# Altium project 4S SMART BMS.PrjPcb (part 3 of 6)

## Sheet MCU.SchDoc
size A4; SheetNumber: 4; SheetTotal: 7
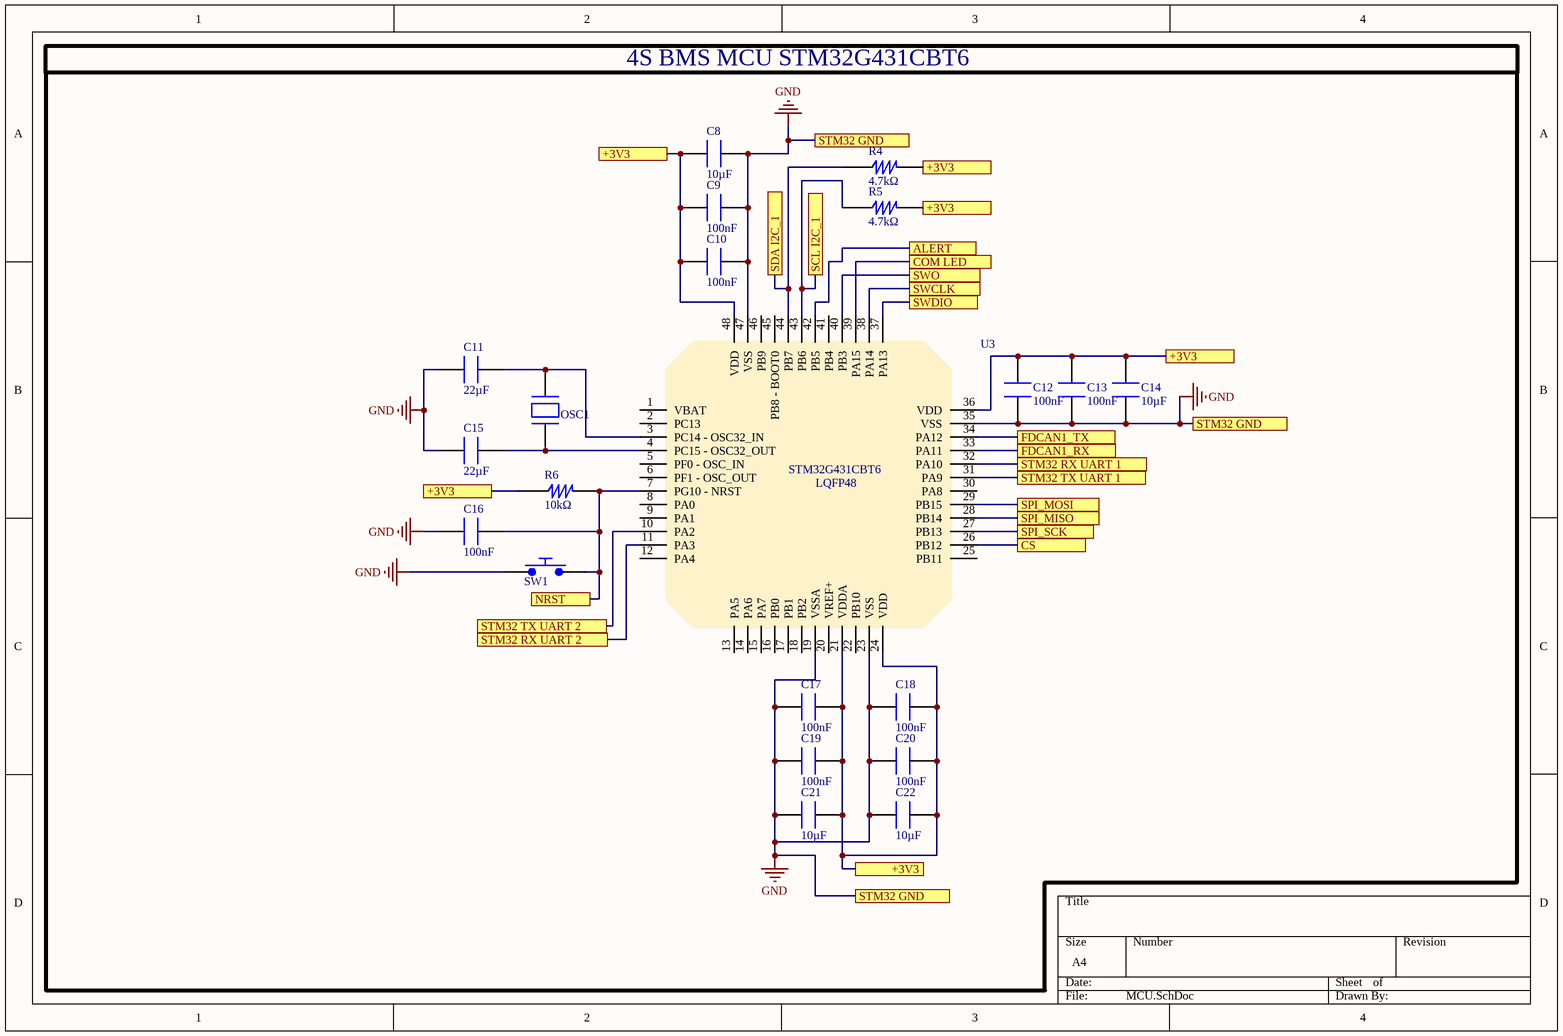
[diagram p3: MCU.SchDoc]

### Parts
C8  value 10µF  [CAP CER 0805]  (hidden comment: CL21B106KQQNNNG)
C9  value 100nF  [CAP CER 0603]  (hidden comment: KGM15AR70J104JT)
C10  value 100nF  [CAP CER 0603]  (hidden comment: KGM15AR70J104JT)
C11  value 22µF  [CAP CER 1210]  (hidden comment: C1210C226J8RACTU)
C12  value 100nF  [CAP CER 0603]  (hidden comment: KGM15AR70J104JT)
C13  value 100nF  [CAP CER 0603]  (hidden comment: KGM15AR70J104JT)
C14  value 10µF  [CAP CER 0805]  (hidden comment: CL21B106KQQNNNG)
C15  value 22µF  [CAP CER 1210]  (hidden comment: C1210C226J8RACTU)
C16  value 100nF  [CAP CER 0603]  (hidden comment: KGM15AR70J104JT)
C17  value 100nF  [CAP CER 0603]  (hidden comment: KGM15AR70J104JT)
C18  value 100nF  [CAP CER 0603]  (hidden comment: KGM15AR70J104JT)
C19  value 100nF  [CAP CER 0603]  (hidden comment: KGM15AR70J104JT)
C20  value 100nF  [CAP CER 0603]  (hidden comment: KGM15AR70J104JT)
C21  value 10µF  [CAP CER 0805]  (hidden comment: CL21B106KQQNNNG)
C22  value 10µF  [CAP CER 0805]  (hidden comment: CL21B106KQQNNNG)
OSC1  END4263D-32M  [OSC_4-SMD, No Lead]  (value not drawn)
R4  value 4.7kΩ  [RES 0603]  (hidden comment: ERA-3AEB472V)
R5  value 4.7kΩ  [RES 0603]  (hidden comment: ERA-3AEB472V)
R6  value 10kΩ  [RES 0603]  (hidden comment: RMCF0603FT10K0)
SW1  PTS636SM50JSMTR LFS  [SWITCH TACTILE]  (value not drawn)
U3  STM32G431CBT6  [LQFP48]  (value not drawn)

### Ports
+3V3 (see COM[1C], COM[3C], COM[3D], COM[4B], ESP32 and Flash[2A], ESP32 and Flash[3A], MCU[2A], MCU[2B], MCU[3A], MCU[3B], MCU[3D], Power[3B], Power[4A]), +3V3 (see COM[1C], COM[3C], COM[3D], COM[4B], ESP32 and Flash[2A], ESP32 and Flash[3A], MCU[2A], MCU[2B], MCU[3A], MCU[3B], Power[3B], Power[4A]), +3V3 (see COM[1C], COM[3C], COM[3D], COM[4B], ESP32 and Flash[2A], ESP32 and Flash[3A], MCU[2A], MCU[2B], MCU[3A], MCU[3D], Power[3B], Power[4A]), +3V3 (see COM[1C], COM[3C], COM[3D], COM[4B], ESP32 and Flash[2A], ESP32 and Flash[3A], MCU[2A], MCU[3A], MCU[3B], MCU[3D], Power[3B], Power[4A]), +3V3 (see COM[1C], COM[3C], COM[3D], COM[4B], ESP32 and Flash[2A], ESP32 and Flash[3A], MCU[2B], MCU[3A], MCU[3B], MCU[3D], Power[3B], Power[4A]), ALERT (see AFE and MOSFETs[2A]), COM LED (see COM[3D]), CS (see ESP32 and Flash[3A]), FDCAN1_RX (see COM[2D]), FDCAN1_TX (see COM[2D]), NRST (see COM[1C], COM[3B]), SCL I2C_1 (see AFE and MOSFETs[1A]), SDA I2C_1 (see AFE and MOSFETs[1A]), SPI_MISO (see ESP32 and Flash[3B]), SPI_MOSI (see ESP32 and Flash[3B]), SPI_SCK (see ESP32 and Flash[3A]), STM32 GND (see COM[1B], COM[1D], COM[2C], COM[2D], COM[3B], COM[4D], ESP32 and Flash[2C], MCU[3A], MCU[3D], Power[1C], Power[2B]), STM32 GND (see COM[1B], COM[1D], COM[2C], COM[2D], COM[3B], COM[4D], ESP32 and Flash[2C], MCU[3A], MCU[4B], Power[1C], Power[2B]), STM32 GND (see COM[1B], COM[1D], COM[2C], COM[2D], COM[3B], COM[4D], ESP32 and Flash[2C], MCU[3D], MCU[4B], Power[1C], Power[2B]), STM32 RX UART 1 (see COM[3B]), STM32 RX UART 2 (see ESP32 and Flash[1B]), STM32 TX UART 1 (see COM[3B]), STM32 TX UART 2 (see ESP32 and Flash[1B]), SWCLK (see COM[1D]), SWDIO (see COM[1D]), SWO (see COM[1D])

### Nets
GND: C8.1 C9.1 C10.1 C11.2 C12.1 C13.1 C14.1 C15.2 C16.2 C17.1 C18.1 C19.1 C20.1 C21.1 C22.1 SW1.1 U3.19(VSSA) U3.23(VSS) U3.35(VSS) U3.47(VSS) ; port STM32 GND
NetC4_1: C8.2 C9.2 C10.2 C12.2 C13.2 C14.2 C17.2 C18.2 C19.2 C20.2 C21.2 C22.2 R4.2 R5.2 R6.1 U3.21(VDDA) U3.24(VDD) U3.36(VDD) U3.48(VDD) ; port +3V3
NetC11_1: C11.1 OSC1.2 U3.3(PC14_-_OSC32_IN)
NetC15_1: C15.1 OSC1.1 U3.4(PC15_-_OSC32_OUT)
NetC16_1: C16.1 R6.2 SW1.2 U3.7(PG10_-_NRST) ; port NRST
NetJ3_2: U3.37(PA13) ; port SWDIO
NetJ3_4: U3.38(PA14) ; port SWCLK
NetJ3_6: U3.40(PB3) ; port SWO
NetR4_1: R4.1 U3.44(PB7) ; port SDA I2C_1
NetR5_1: R5.1 U3.43(PB6) ; port SCL I2C_1
NetR16_1: U3.39(PA15) ; port COM LED
NetU3_10: U3.10(PA2) ; port STM32 TX UART 2
NetU3_11: U3.11(PA3) ; port STM32 RX UART 2
NetU3_26: U3.26(PB12) ; port CS
NetU3_27: U3.27(PB13) ; port SPI_SCK
NetU3_28: U3.28(PB14) ; port SPI_MISO
NetU3_29: U3.29(PB15) ; port SPI_MOSI
NetU3_31: U3.31(PA9) ; port STM32 TX UART 1
NetU3_32: U3.32(PA10) ; port STM32 RX UART 1
NetU3_33: U3.33(PA11) ; port FDCAN1_RX
NetU3_34: U3.34(PA12) ; port FDCAN1_TX
NetU3_42: U3.42(PB5) ; port ALERT

Not connected (* = marked no-connect by the designer): U3 1(VBAT) 2(PC13) 5(PF0_-_OSC_IN) 6(PF1_-_OSC_OUT) 8(PA0) 9(PA1) 12(PA4) 13(PA5) 14(PA6) 15(PA7) 16(PB0) 17(PB1) 18(PB2) 20(VREF+) 22(PB10) 25(PB11) 30(PA8) 41(PB4) 45(PB8_-_BOOT0) 46(PB9)

### Notes on the sheet
- 4S BMS MCU STM32G431CBT6
- (in symbol STM32G431CBT6) LQFP48

### Library data of the parts
C8 C14 C21 C22 = CAP CER 10UF 6.3V 0805: 10 µF ±10% 6.3V Ceramic Capacitor X7R 0805 (2012 Metric); Manufacturer: Samsung Electro-Mechanics; Supplier: Arrow Electronics; Supplier Part Number: CL21B106KQQNNNG; Manufacturer Part Number: CL21B106KQQNNNG; RoHS: Compliant; Category: Ceramic Capacitors; Stock: 330626; Pricing: 1=0,0256, 10=0,011, 25=0,011, 100=0,008, 250=0,008, 500=0,007, 1000=0,006, 3000=0,006, 6000=0,005, 15000=0,005, 30000=0,005, 75000=0,004, 150000=0,004 (USD); Case/Package: 0805; Case Code (Imperial): 0805; Case Code (Metric): 2012; China RoHS: Compliant; Depth: 1.25mm; Dielectric: X7R; Dielectric Material: Ceramic; Height: 1.4mm; Lead Free: Lead Free; Length: 2mm; Lifecycle Status: Production; Material: Ceramic; Max Operating Temperature: 125°C; Min Operating Temperature: -55°C; Mounting Technology: Surface Mount; Number of Terminals: 2; REACH SVHC: Yes; Schedule B: 8532240020, 8532240020|8532240020, 8532240020|8532240020|8532240020, 8532240020|8532240020|8532240020|8532240020; Thickness: 1.397mm; Tolerance: 10%; Voltage: 6.3V; Voltage Rating: 6.3V; Voltage Rating (DC): 6.3V; Width: 1.25mm; ComponentLink1URL: https://datasheet.octopart.com:443/CL21B106KQQNNNG-Samsung-Electro-Mechanics-datasheet-182023452.pdf?src-supplier=IHS; ComponentLink1Description: https://datasheet.octopart.com:443/CL21B106KQQNNNG-Samsung-Electro-Mechanics-datasheet-182023452.pdf?src-supplier=IHS; ComponentLink2URL: https://datasheet.octopart.com:443/CL21B106KQQNNNG-Samsung-Electro-Mechanics-datasheet-136482505.pdf?src-supplier=Samsung+SCT; ComponentLink2Description: https://datasheet.octopart.com:443/CL21B106KQQNNNG-Samsung-Electro-Mechanics-datasheet-136482505.pdf?src-supplier=Samsung+SCT; ComponentLink3URL: https://datasheet.octopart.com:443/CL21B106KQQNNNG-Samsung-Electro-Mechanics-datasheet-116891051.pdf?src-supplier=Future+Electronics; ComponentLink3Description: https://datasheet.octopart.com:443/CL21B106KQQNNNG-Samsung-Electro-Mechanics-datasheet-116891051.pdf?src-supplier=Future+Electronics; ComponentLink4URL: https://datasheet.octopart.com:443/CL21B106KQQNNNG-Samsung-Electro-Mechanics-datasheet-81462194.pdf?src-supplier=Future+Electronics; ComponentLink4Description: https://datasheet.octopart.com:443/CL21B106KQQNNNG-Samsung-Electro-Mechanics-datasheet-81462194.pdf?src-supplier=Future+Electronics; ComponentLink5URL: https://datasheet.octopart.com:443/CL21B106KQQNNNG-Samsung-datasheet-26669288.pdf?src-supplier=Future+Electronics; ComponentLink5Description: https://datasheet.octopart.com:443/CL21B106KQQNNNG-Samsung-datasheet-26669288.pdf?src-supplier=Future+Electronics; ComponentLink6URL: https://datasheet.octopart.com:443/CL21B106KQQNNNG-Samsung-datasheet-8324245.pdf?src-supplier=Future+Electronics; ComponentLink6Description: https://datasheet.octopart.com:443/CL21B106KQQNNNG-Samsung-datasheet-8324245.pdf?src-supplier=Future+Electronics; ComponentLink7URL: https://datasheet.octopart.com:443/CL21B106KQQNNNG-Samsung-Electro-Mechanics-datasheet-149045989.pdf?src-supplier=Future+Electronics; ComponentLink7Description: https://datasheet.octopart.com:443/CL21B106KQQNNNG-Samsung-Electro-Mechanics-datasheet-149045989.pdf?src-supplier=Future+Electronics; ComponentLink8URL: https://datasheet.octopart.com:443/CL21B106KQQNNNG-Samsung-datasheet-37081328.pdf?src-supplier=Future+Electronics; ComponentLink8Description: https://datasheet.octopart.com:443/CL21B106KQQNNNG-Samsung-datasheet-37081328.pdf?src-supplier=Future+Electronics; ComponentLink9URL: https://datasheet.octopart.com/CL21B106KQQNNNG-Samsung-Electro-Mechanics-datasheet-97040617.pdf; ComponentLink9Description: https://datasheet.octopart.com/CL21B106KQQNNNG-Samsung-Electro-Mechanics-datasheet-97040617.pdf; ComponentLink10URL: https://datasheet.octopart.com:443/CL21B106KQQNNNG-Samsung-datasheet-59220082.pdf?src-supplier=TME; ComponentLink10Description: https://datasheet.octopart.com:443/CL21B106KQQNNNG-Samsung-datasheet-59220082.pdf?src-supplier=TME
C9 C10 C12 C13 C16-C20 = CAP CER 0.1UF 6.3V 0603: 0.1 µF ±5% 6.3V Ceramic Capacitor X7R 0603 (1608 Metric); Manufacturer: KYOCERA AVX; Supplier: Arrow Electronics; Supplier Part Number: KGM15AR70J104JT; Manufacturer Part Number: KGM15AR70J104JT; RoHS: Compliant; Category: Ceramic Capacitors; Stock: 2087; Pricing: 1=0,019, 10=0,019, 25=0,019, 100=0,018, 250=0,018, 500=0,018, 1000=0,018 (USD); Dielectric Material: Ceramic; Height: 900µm; Length: 1.6mm; Lifecycle Status: Production; Max Operating Temperature: 125°C; Min Operating Temperature: -55°C; Mounting Technology: Surface Mount; Number of Terminals: 2; REACH SVHC: Yes; Voltage Rating (DC): 6.3V; Width: 810µm; ComponentLink1URL: https://datasheet.octopart.com:443/KGM15AR70J104JT-KYOCERA-AVX-datasheet-179280988.pdf?src-supplier=IHS; ComponentLink1Description: https://datasheet.octopart.com:443/KGM15AR70J104JT-KYOCERA-AVX-datasheet-179280988.pdf?src-supplier=IHS
C11 C15 = CAP CER 22UF 10V 1210: CAP CER 22UF 10V X7R 1210; Manufacturer: KEMET; Dielectric Material: Ceramic; Tolerance: 5%; Supplier: Arrow Electronics; Supplier Part Number: C1210C226J8RACTU; Manufacturer Part Number: C1210C226J8RACTU; RoHS: Compliant; Category: Ceramic Capacitors; Pricing: 1000=2,466, 2000=2,456, 3000=2,445, 4000=2,434, 5000=2,422, 6000=2,411, 10000=2,4, 20000=2,388, 50000=2,376 (USD); Case/Package: 1210; China RoHS: Compliant; Dielectric: X7R; Height: 2.5mm; Length: 3.2mm; Lifecycle Status: Production; Max Operating Temperature: 125°C; Min Operating Temperature: -55°C; Mounting Technology: Surface Mount; Number of Terminals: 2; REACH SVHC: Yes; Voltage Rating (DC): 10V; Width: 2.5mm; ComponentLink1URL: https://datasheet.octopart.com:443/C1210C226J8RACTU-KEMET-datasheet-178445679.pdf?src-supplier=IHS; ComponentLink1Description: https://datasheet.octopart.com:443/C1210C226J8RACTU-KEMET-datasheet-178445679.pdf?src-supplier=IHS; ComponentLink2URL: https://datasheet.octopart.com/C1210C226J8RACTU-KEMET-datasheet-84169754.pdf; ComponentLink2Description: https://datasheet.octopart.com/C1210C226J8RACTU-KEMET-datasheet-84169754.pdf
OSC1 = 32 MHz OSCİLLATOR: 32 MHz TCXO Clipped Sine Wave Oscillator 1.65V ~ 3.65V 4-SMD, No Lead; Base Resonator: Crystal; Frequency: 32 MHz; Frequency Stability: ±2.5ppm; Current - Supply (Max): 2mA; Type: TCXO; Output: Clipped Sine Wave; Voltage - Supply: 1.65V ~ 3.65V; Operating Temperature: -30°C ~ 85°C; Mounting Type: Surface Mount; Package / Case: 4-SMD, No Lead; Size / Dimension: 0.079" L x 0.063" W (2.00mm x 1.60mm)
R4 R5 = RES 4.7K OHM 1/10W 0603: Res Thin Film 0603 4.7K Ohm 0.1% 0.1W ±25ppm/°C Molded SMD Punched Carrier T/R; Manufacturer: Panasonic; Manufacturer Part Number: ERA-3AEB473V; Max Power Dissipation: 100mW; Voltage Rating: 75V; Supplier: Arrow Electronics; Supplier Part Number: ERA-3AEB473V; RoHS: Compliant; Category: Chip SMD Resistors; Stock: 25000; Pricing: 5000=0,0337, 10000=0,032, 15000=0,031, 20000=0,031, 25000=0,03 (USD); Case/Package: 0603; Case Code (Imperial): 0603; Composition: Thin Film; Contact Plating: Tin; Depth: 800µm; Features: Automotive AEC-Q200; Height: 450µm; Lead Free: Lead Free; Length: 1.6mm; Lifecycle Status: Production; Max Operating Temperature: 155°C; Military Standard: Not; Min Operating Temperature: -55°C; Mounting Technology: Surface Mount; Pins: 2; Number of Terminals: 2; Number of Terminations: 2; Packaging: Cut Tape; Power Dissipation: 100mW; Power Rating: 100mW; Radiation Hardening: No; REACH SVHC: Yes; Schedule B: 8533210045, 8533210045|8533210045|8533210045|8533210045|8533210045; Temperature Coefficient: 25ppm/°C; Termination: SMD/SMT; Tolerance: 0.1%; Voltage Rating (DC): 75V; Width: 800µm; Working Voltage: 75V; ComponentLink1URL: https://datasheet.octopart.com:443/ERA-3AEB473V-Panasonic-datasheet-62287448.pdf?src-supplier=Newark; ComponentLink1Description: https://datasheet.octopart.com:443/ERA-3AEB473V-Panasonic-datasheet-62287448.pdf?src-supplier=Newark; ComponentLink2URL: https://datasheet.octopart.com:443/ERA-3AEB473V-Panasonic-datasheet-136531316.pdf?src-supplier=Newark; ComponentLink2Description: https://datasheet.octopart.com:443/ERA-3AEB473V-Panasonic-datasheet-136531316.pdf?src-supplier=Newark; ComponentLink3URL: https://datasheet.octopart.com:443/ERA-3AEB473V-Panasonic-datasheet-8367715.pdf?src-supplier=Newark; ComponentLink3Description: https://datasheet.octopart.com:443/ERA-3AEB473V-Panasonic-datasheet-8367715.pdf?src-supplier=Newark; ComponentLink4URL: https://datasheet.octopart.com:443/ERA-3AEB473V-Panasonic-datasheet-61114971.pdf?src-supplier=Newark; ComponentLink4Description: https://datasheet.octopart.com:443/ERA-3AEB473V-Panasonic-datasheet-61114971.pdf?src-supplier=Newark; ComponentLink5URL: https://datasheet.octopart.com:443/ERA-3AEB473V-Panasonic-datasheet-13266200.pdf?src-supplier=_legacy+Avnet; ComponentLink5Description: https://datasheet.octopart.com:443/ERA-3AEB473V-Panasonic-datasheet-13266200.pdf?src-supplier=_legacy+Avnet; ComponentLink6URL: https://datasheet.octopart.com:443/ERA-3AEB473V-Panasonic-datasheet-118567.pdf?src-supplier=element14; ComponentLink6Description: https://datasheet.octopart.com:443/ERA-3AEB473V-Panasonic-datasheet-118567.pdf?src-supplier=element14; ComponentLink7URL: https://datasheet.octopart.com:443/ERA-3AEB473V-Panasonic-datasheet-154766165.pdf?src-supplier=Master+Electronics; ComponentLink7Description: https://datasheet.octopart.com:443/ERA-3AEB473V-Panasonic-datasheet-154766165.pdf?src-supplier=Master+Electronics; ComponentLink8URL: https://datasheet.octopart.com:443/ERA-3AEB473V-Panasonic-datasheet-12510007.pdf?src-supplier=Future+Electronics; ComponentLink8Description: https://datasheet.octopart.com:443/ERA-3AEB473V-Panasonic-datasheet-12510007.pdf?src-supplier=Future+Electronics; ComponentLink9URL: https://datasheet.octopart.com:443/ERA-3AEB473V-Panasonic-datasheet-11763931.pdf?src-supplier=Future+Electronics; ComponentLink9Description: https://datasheet.octopart.com:443/ERA-3AEB473V-Panasonic-datasheet-11763931.pdf?src-supplier=Future+Electronics; ComponentLink10URL: https://datasheet.octopart.com:443/ERA-3AEB473V-Panasonic-datasheet-10840895.pdf?src-supplier=Future+Electronics; ComponentLink10Description: https://datasheet.octopart.com:443/ERA-3AEB473V-Panasonic-datasheet-10840895.pdf?src-supplier=Future+Electronics; ComponentLink11URL: https://datasheet.octopart.com:443/ERA-3AEB473V-Panasonic-datasheet-5392808.pdf?src-supplier=Future+Electronics; ComponentLink11Description: https://datasheet.octopart.com:443/ERA-3AEB473V-Panasonic-datasheet-5392808.pdf?src-supplier=Future+Electronics; ComponentLink12URL: https://datasheet.octopart.com:443/ERA-3AEB473V-Panasonic-datasheet-46744048.pdf?src-supplier=RS+(Formerly+Allied+Electronics); ComponentLink12Description: https://datasheet.octopart.com:443/ERA-3AEB473V-Panasonic-datasheet-46744048.pdf?src-supplier=RS+(Formerly+Allied+Electronics); ComponentLink13URL: https://datasheet.octopart.com:443/ERA3AEB473V-Panasonic-datasheet-188913046.pdf?src-supplier=TME; ComponentLink13Description: https://datasheet.octopart.com:443/ERA3AEB473V-Panasonic-datasheet-188913046.pdf?src-supplier=TME; ComponentLink14URL: https://sigma.octopart.com:443/150570796/technical_drawing/Panasonic-ERA3AEB473V.pdf?src-supplier=Panasonic+SCT; ComponentLink14Description: https://sigma.octopart.com:443/150570796/technical_drawing/Panasonic-ERA3AEB473V.pdf?src-supplier=Panasonic+SCT; ComponentLink15URL: https://datasheet.octopart.com:443/ERA3AEB473V-Panasonic-datasheet-138783076.pdf?src-supplier=Burklin+Elektronik; ComponentLink15Description: https://datasheet.octopart.com:443/ERA3AEB473V-Panasonic-datasheet-138783076.pdf?src-supplier=Burklin+Elektronik; ComponentLink16URL: https://datasheet.octopart.com/ERA-3AEB473V-Panasonic-datasheet-78375410.pdf; ComponentLink16Description: https://datasheet.octopart.com/ERA-3AEB473V-Panasonic-datasheet-78375410.pdf; ComponentLink17URL: https://datasheet.octopart.com:443/ERA3AEB473V-Panasonic---ECG-datasheet-15994758.pdf?src-supplier=Farnell; ComponentLink17Description: https://datasheet.octopart.com:443/ERA3AEB473V-Panasonic---ECG-datasheet-15994758.pdf?src-supplier=Farnell; ComponentLink18URL: https://datasheet.octopart.com:443/ERA3AEB473V-Panasonic-datasheet-10050158.pdf?src-supplier=Arrow+Electronics; ComponentLink18Description: https://datasheet.octopart.com:443/ERA3AEB473V-Panasonic-datasheet-10050158.pdf?src-supplier=Arrow+Electronics; ComponentLink19URL: https://datasheet.octopart.com:443/ERA-3AEB473V-Panasonic-datasheet-33006989.pdf?src-supplier=Electro+Sonic; ComponentLink19Description: https://datasheet.octopart.com:443/ERA-3AEB473V-Panasonic-datasheet-33006989.pdf?src-supplier=Electro+Sonic; ComponentLink20URL: https://datasheet.octopart.com:443/ERA-3AEB472V-Panasonic-datasheet-138783076.pdf?src-supplier=Burklin+Elektronik; ComponentLink20Description: https://datasheet.octopart.com:443/ERA-3AEB472V-Panasonic-datasheet-138783076.pdf?src-supplier=Burklin+Elektronik; ComponentLink21URL: https://sigma.octopart.com:443/138766958/technical_drawing/Panasonic-ERA-3AEB472V.pdf?src-supplier=Upverter; ComponentLink21Description: https://sigma.octopart.com:443/138766958/technical_drawing/Panasonic-ERA-3AEB472V.pdf?src-supplier=Upverter; ComponentLink22URL: https://datasheet.octopart.com:443/ERA-3AEB472V-Panasonic-datasheet-62287448.pdf?src-supplier=Newark; ComponentLink22Description: https://datasheet.octopart.com:443/ERA-3AEB472V-Panasonic-datasheet-62287448.pdf?src-supplier=Newark; ComponentLink23URL: https://datasheet.octopart.com:443/ERA-3AEB472V-Panasonic-datasheet-8367715.pdf?src-supplier=Newark; ComponentLink23Description: https://datasheet.octopart.com:443/ERA-3AEB472V-Panasonic-datasheet-8367715.pdf?src-supplier=Newark; ComponentLink24URL: https://datasheet.octopart.com:443/ERA-3AEB472V-Panasonic-datasheet-136531316.pdf?src-supplier=Farnell; ComponentLink24Description: https://datasheet.octopart.com:443/ERA-3AEB472V-Panasonic-datasheet-136531316.pdf?src-supplier=Farnell; ComponentLink25URL: https://datasheet.octopart.com:443/ERA3AEB472V-Panasonic---ECG-datasheet-15994758.pdf?src-supplier=Farnell; ComponentLink25Description: https://datasheet.octopart.com:443/ERA3AEB472V-Panasonic---ECG-datasheet-15994758.pdf?src-supplier=Farnell; ComponentLink26URL: https://datasheet.octopart.com:443/ERA-3AEB472V-Panasonic-datasheet-13266200.pdf?src-supplier=_legacy+Avnet; ComponentLink26Description: https://datasheet.octopart.com:443/ERA-3AEB472V-Panasonic-datasheet-13266200.pdf?src-supplier=_legacy+Avnet; ComponentLink27URL: https://datasheet.octopart.com:443/ERA-3AEB472V-Panasonic-datasheet-10840895.pdf?src-supplier=Future+Electronics; ComponentLink27Description: https://datasheet.octopart.com:443/ERA-3AEB472V-Panasonic-datasheet-10840895.pdf?src-supplier=Future+Electronics; ComponentLink28URL: https://datasheet.octopart.com:443/ERA-3AEB472V-Panasonic-datasheet-12510007.pdf?src-supplier=Future+Electronics; ComponentLink28Description: https://datasheet.octopart.com:443/ERA-3AEB472V-Panasonic-datasheet-12510007.pdf?src-supplier=Future+Electronics; ComponentLink29URL: https://datasheet.octopart.com:443/ERA-3AEB472V-Panasonic-datasheet-11763931.pdf?src-supplier=Future+Electronics; ComponentLink29Description: https://datasheet.octopart.com:443/ERA-3AEB472V-Panasonic-datasheet-11763931.pdf?src-supplier=Future+Electronics; ComponentLink30URL: https://datasheet.octopart.com:443/ERA-3AEB472V-Panasonic-datasheet-5392808.pdf?src-supplier=Future+Electronics; ComponentLink30Description: https://datasheet.octopart.com:443/ERA-3AEB472V-Panasonic-datasheet-5392808.pdf?src-supplier=Future+Electronics; ComponentLink31URL: https://datasheet.octopart.com:443/ERA-3AEB472V-Panasonic-datasheet-61114971.pdf?src-supplier=Future+Electronics; ComponentLink31Description: https://datasheet.octopart.com:443/ERA-3AEB472V-Panasonic-datasheet-61114971.pdf?src-supplier=Future+Electronics; ComponentLink32URL: https://datasheet.octopart.com:443/ERA-3AEB472V-Panasonic-datasheet-118567.pdf?src-supplier=element14; ComponentLink32Description: https://datasheet.octopart.com:443/ERA-3AEB472V-Panasonic-datasheet-118567.pdf?src-supplier=element14; ComponentLink33URL: https://datasheet.octopart.com:443/ERA-3AEB472V-Panasonic-datasheet-154766165.pdf?src-supplier=Master+Electronics; ComponentLink33Description: https://datasheet.octopart.com:443/ERA-3AEB472V-Panasonic-datasheet-154766165.pdf?src-supplier=Master+Electronics; ComponentLink34URL: https://datasheet.octopart.com:443/ERA-3AEB472V-Panasonic-datasheet-46744048.pdf?src-supplier=RS+(Formerly+Allied+Electronics); ComponentLink34Description: https://datasheet.octopart.com:443/ERA-3AEB472V-Panasonic-datasheet-46744048.pdf?src-supplier=RS+(Formerly+Allied+Electronics); ComponentLink35URL: https://datasheet.octopart.com:443/ERA3AEB472V-Panasonic-datasheet-188913046.pdf?src-supplier=TME; ComponentLink35Description: https://datasheet.octopart.com:443/ERA3AEB472V-Panasonic-datasheet-188913046.pdf?src-supplier=TME; ComponentLink36URL: https://sigma.octopart.com:443/150570796/technical_drawing/Panasonic-ERA3AEB472V.pdf?src-supplier=Panasonic+SCT; ComponentLink36Description: https://sigma.octopart.com:443/150570796/technical_drawing/Panasonic-ERA3AEB472V.pdf?src-supplier=Panasonic+SCT; ComponentLink37URL: https://datasheet.octopart.com/ERA-3AEB472V-Panasonic-datasheet-78375410.pdf; ComponentLink37Description: https://datasheet.octopart.com/ERA-3AEB472V-Panasonic-datasheet-78375410.pdf; ComponentLink38URL: https://datasheet.octopart.com:443/ERA-3AEB472V-Panasonic-datasheet-33006989.pdf?src-supplier=Electro+Sonic; ComponentLink38Description: https://datasheet.octopart.com:443/ERA-3AEB472V-Panasonic-datasheet-33006989.pdf?src-supplier=Electro+Sonic
R6 = RES 10K OHM 1/10W 0603: RES 10K OHM 1% 1/10W 0603; Manufacturer: Stackpole Electronics; Max Power Dissipation: 100mW; Temperature Coefficient: 100ppm/°C; Voltage Rating: 75V; Supplier: Arrow Electronics; Supplier Part Number: RMCF0603FT10K0; Manufacturer Part Number: RMCF0603FT10K0; RoHS: Compliant; Category: Chip SMD Resistors; Stock: 2390000; Pricing: 50000=0,0018 (USD); Case/Package: 0603; Case Code (Imperial): 0603; Case Code (Metric): 1608; China RoHS: Non-Compliant; Composition: Thick Film; Contact Plating: Tin; Depth: 800µm; Features: Automotive AEC-Q200; Height: 450µm; Lead Free: Lead Free; Length: 1.55mm; Lifecycle Status: Production; Max Operating Temperature: 155°C; Military Standard: Not; Min Operating Temperature: -55°C; Mounting Technology: Surface Mount; Number of Terminals: 2; Number of Terminations: 2; Packaging: Cut Tape (CT); Power Dissipation: 100mW; Power Rating: 100mW; Radiation Hardening: No; REACH SVHC: Yes; Schedule B: 8533210045, 8533210045|8533210045, 8533210045|8533210045|8533210045, 8533210045|8533210045|8533210045|8533210045; Tolerance: 1%; Width: 800µm; Working Voltage: 75V; ComponentLink1URL: https://datasheet.octopart.com:443/RMCF0603FT10K0-Stackpole-Electronics-datasheet-182148065.pdf?src-supplier=IHS; ComponentLink1Description: https://datasheet.octopart.com:443/RMCF0603FT10K0-Stackpole-Electronics-datasheet-182148065.pdf?src-supplier=IHS; ComponentLink2URL: https://datasheet.octopart.com:443/RMCF0603FT10K0-Stackpole-Electronics-datasheet-28504820.pdf?src-supplier=Upverter; ComponentLink2Description: https://datasheet.octopart.com:443/RMCF0603FT10K0-Stackpole-Electronics-datasheet-28504820.pdf?src-supplier=Upverter; ComponentLink3URL: https://datasheet.octopart.com:443/RMCF0603FT10K0-Stackpole-Electronics-datasheet-141193804.pdf?src-supplier=Stackpole+Electronics; ComponentLink3Description: https://datasheet.octopart.com:443/RMCF0603FT10K0-Stackpole-Electronics-datasheet-141193804.pdf?src-supplier=Stackpole+Electronics; ComponentLink4URL: https://datasheet.octopart.com:443/RMCF0603FT10K0-Stackpole-Electronics-datasheet-62091608.pdf?src-supplier=Stackpole+Electronics; ComponentLink4Description: https://datasheet.octopart.com:443/RMCF0603FT10K0-Stackpole-Electronics-datasheet-62091608.pdf?src-supplier=Stackpole+Electronics; ComponentLink5URL: https://datasheet.octopart.com:443/RMCF0603FT10K0-Stackpole-Electronics-datasheet-12534581.pdf?src-supplier=Stackpole+Electronics; ComponentLink5Description: https://datasheet.octopart.com:443/RMCF0603FT10K0-Stackpole-Electronics-datasheet-12534581.pdf?src-supplier=Stackpole+Electronics; ComponentLink6URL: https://datasheet.octopart.com:443/RMCF0603FT10K0-Stackpole-Electronics-datasheet-10788263.pdf?src-supplier=Stackpole+Electronics; ComponentLink6Description: https://datasheet.octopart.com:443/RMCF0603FT10K0-Stackpole-Electronics-datasheet-10788263.pdf?src-supplier=Stackpole+Electronics; ComponentLink7URL: https://datasheet.octopart.com:443/RMCF0603FT10K0-Stackpole-Electronics-datasheet-155966809.pdf?src-supplier=Electro+Sonic; ComponentLink7Description: https://datasheet.octopart.com:443/RMCF0603FT10K0-Stackpole-Electronics-datasheet-155966809.pdf?src-supplier=Electro+Sonic; ComponentLink8URL: https://datasheet.octopart.com:443/RMCF0603FT10K0-Stackpole-Electronics-datasheet-189104164.pdf?src-supplier=Master+Electronics; ComponentLink8Description: https://datasheet.octopart.com:443/RMCF0603FT10K0-Stackpole-Electronics-datasheet-189104164.pdf?src-supplier=Master+Electronics; ComponentLink9URL: https://datasheet.octopart.com:443/RMCF0603FT10K0-Stackpole-Electronics-datasheet-154799224.pdf?src-supplier=Master+Electronics; ComponentLink9Description: https://datasheet.octopart.com:443/RMCF0603FT10K0-Stackpole-Electronics-datasheet-154799224.pdf?src-supplier=Master+Electronics; ComponentLink10URL: https://datasheet.octopart.com:443/RMCF0603FT10K0-Stackpole-Electronics-datasheet-11546843.pdf?src-supplier=Arrow+Electronics; ComponentLink10Description: https://datasheet.octopart.com:443/RMCF0603FT10K0-Stackpole-Electronics-datasheet-11546843.pdf?src-supplier=Arrow+Electronics; ComponentLink11URL: https://datasheet.octopart.com:443/RMCF0603FT10K0-Stackpole-Electronics-datasheet-11547379.pdf?src-supplier=Future+Electronics; ComponentLink11Description: https://datasheet.octopart.com:443/RMCF0603FT10K0-Stackpole-Electronics-datasheet-11547379.pdf?src-supplier=Future+Electronics; ComponentLink12URL: https://datasheet.octopart.com:443/RMCF0603FT10K0-Stackpole-Electronics-datasheet-8359789.pdf?src-supplier=Future+Electronics; ComponentLink12Description: https://datasheet.octopart.com:443/RMCF0603FT10K0-Stackpole-Electronics-datasheet-8359789.pdf?src-supplier=Future+Electronics; ComponentLink13URL: https://datasheet.octopart.com:443/RMCF0603FT10K0-Stackpole-Electronics-datasheet-8324226.pdf?src-supplier=Future+Electronics; ComponentLink13Description: https://datasheet.octopart.com:443/RMCF0603FT10K0-Stackpole-Electronics-datasheet-8324226.pdf?src-supplier=Future+Electronics; ComponentLink14URL: http://sigma.octopart.com:80/15940719/materials_sheet/Stackpole-Electronics-RMCF0603FT10K0.pdf?src-supplier=Compliance+Statements; ComponentLink14Description: http://sigma.octopart.com:80/15940719/materials_sheet/Stackpole-Electronics-RMCF0603FT10K0.pdf?src-supplier=Compliance+Statements; ComponentLink15URL: http://sigma.octopart.com:80/141158211/reach_statement/Stackpole-Electronics-RMCF0603FT10K0.pdf?src-supplier=Compliance+Statements; ComponentLink15Description: http://sigma.octopart.com:80/141158211/reach_statement/Stackpole-Electronics-RMCF0603FT10K0.pdf?src-supplier=Compliance+Statements; ComponentLink16URL: http://sigma.octopart.com:80/141158212/rohs_statement/Stackpole-Electronics-RMCF0603FT10K0.pdf?src-supplier=Compliance+Statements; ComponentLink16Description: http://sigma.octopart.com:80/141158212/rohs_statement/Stackpole-Electronics-RMCF0603FT10K0.pdf?src-supplier=Compliance+Statements
SW1 = SWITCH TACTILE 0.05A 12V: Switch Tactile Spst-no 0.05A 12V; Manufacturer: C&K Components; Contact Resistance: 100mΩ; Number of Positions: 2; Supplier: Mouser; Supplier Part Number: 611-PTS636SM50JSMTRL; Manufacturer Part Number: PTS636SM50JSMTR LFS; Category: Tactile Switches; Stock: 6250; Pricing: 1=0,21, 10=0,183, 50=0,172, 100=0,155, 1000=0,123, 10000=0,112 (USD); ComponentLink1URL: https://datasheet.octopart.com:443/PTS636SM50JSMTR-LFS-C%26K-Components-datasheet-166147775.pdf?src-supplier=TME; ComponentLink1Description: https://datasheet.octopart.com:443/PTS636SM50JSMTR-LFS-C%26K-Components-datasheet-166147775.pdf?src-supplier=TME
U3 = STM32G431CBT6: IC MCU 32BIT 128KB FLASH 48LQFP; Manufacturer: STMicroelectronics; Clock Rate: 48MHz; Core Architecture: ARM Cortex-M4; Data Bus Width: 32b; EEPROM Memory Size: 0B; Frequency: 170MHz; Interface: USB; Max Junction Temperature (Tj): 105°C; Max Supply Current: 29mA; Max Supply Voltage: 3.6V; Min Supply Voltage: 1.71V; Number of A/D Converters: 1; Number of ADC Channels: 17; Number of D/A Converters: 2; Number of I2C Channels: 3; Number of I/Os: 5; Number of Interrupts: 16; Number of PWM Channels: 31; Number of Timers/Counters: 12; Number of UART Channels: 4; Operating Supply Voltage: 3V; RAM Size: 32kB; Supplier: Arrow Electronics; Supplier Part Number: STM32G431CBT6; Manufacturer Part Number: STM32G431CBT6; RoHS: Compliant; Category: Microcontrollers; Stock: 32983; Pricing: 1=4,083, 10=3,333, 25=3,084, 100=2,983, 250=2,847, 500=2,627 (USD); Ambient Temperature Range High: 85°C; China RoHS: Compliant; Flash Memory Size: 128kB; Height: 1.6mm; Height - Seated (Max): 1.6mm; Length: 7mm; Lifecycle Status: Production; Max Operating Temperature: 85°C; Memory Size: 128kB; Memory Format: FLASH; Min Operating Temperature: -40°C; Number of SPI Channels: 3; Number of Terminals: 48; Number of USART Channels: 3; Number of USB Channels: 1; REACH SVHC: Yes; Schedule B: 8542310000, 8542310000|8542310000|8542310000|8542310000|8542310000; Terminal Pitch: 500µm; Width: 7mm; ComponentLink1URL: https://datasheet.octopart.com:443/STM32G431CBT6-STMicroelectronics-datasheet-136120343.pdf?src-supplier=Future+Electronics; ComponentLink1Description: https://datasheet.octopart.com:443/STM32G431CBT6-STMicroelectronics-datasheet-136120343.pdf?src-supplier=Future+Electronics

## Sheet COM.SchDoc
size A4; SheetNumber: 5; SheetTotal: 7
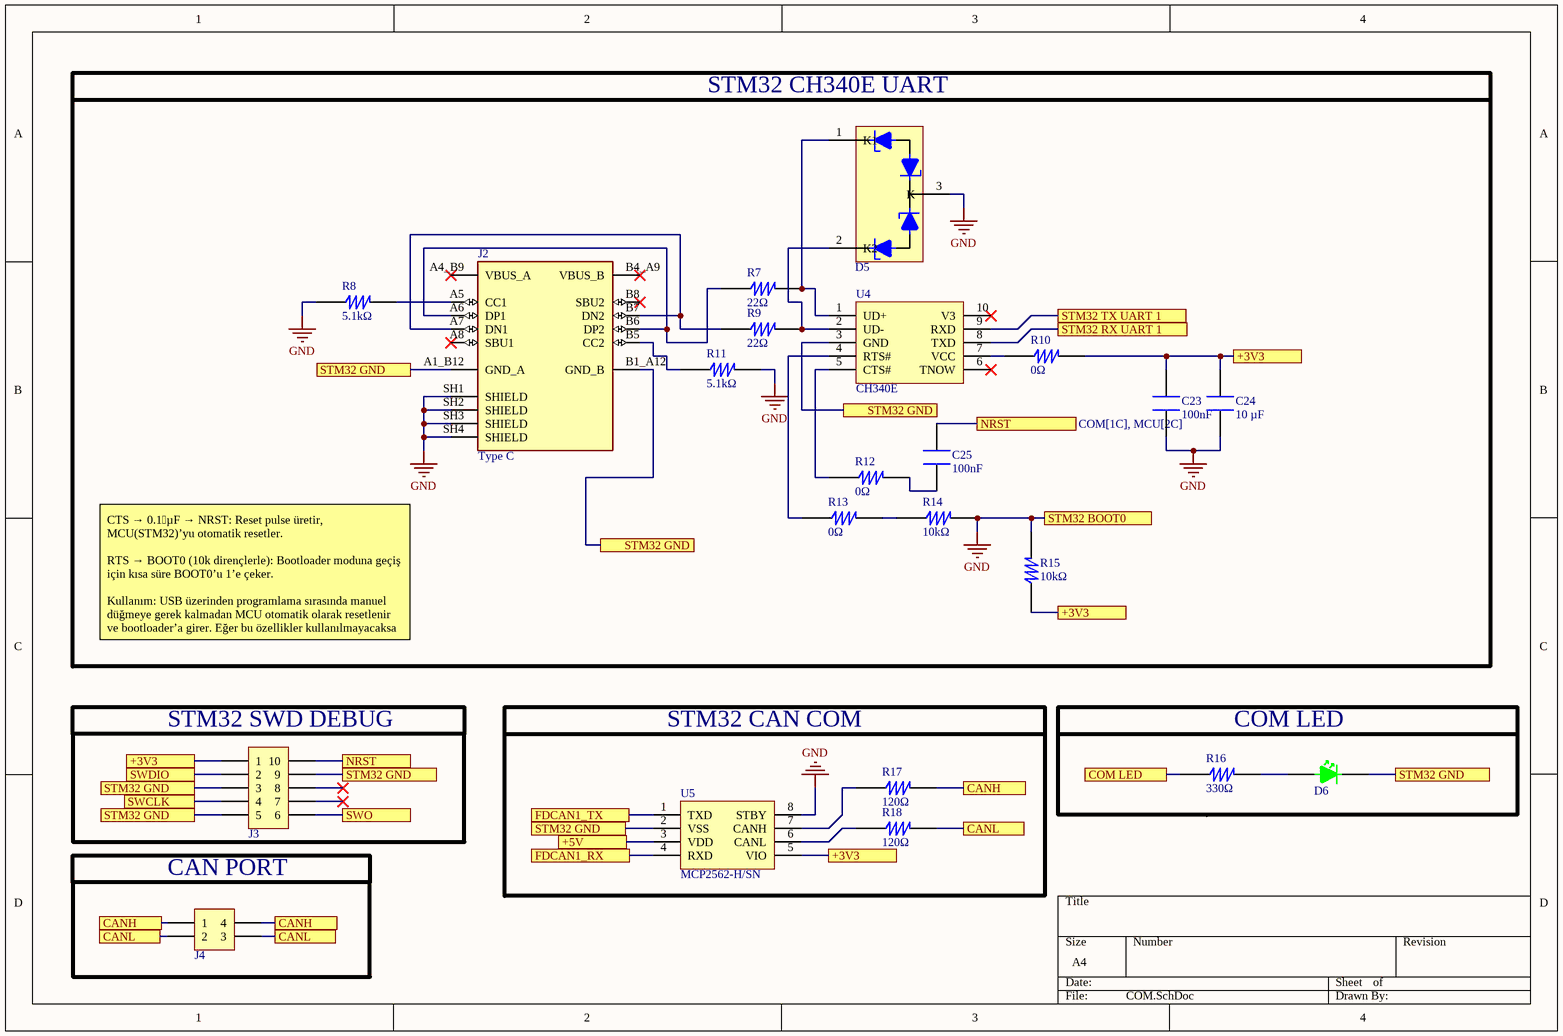
[diagram p4: COM.SchDoc]

### Parts
C23  value 100nF  [CAP CER 0603]  (hidden comment: KGM15AR70J104JT)
C24  Capacitance: 10 µF  [CAP CER 0805]  (hidden comment: 0805W106K500CC)
C25  value 100nF  [CAP CER 0603]  (hidden comment: KGM15AR70J104JT)
D5  PESD5V0S2BT,215  [SOT-23]  (value not drawn)
D6  LTST-C190GKT  [LED 0603]  (value not drawn)
J2  Model: Type C  [TYPE-C]  (hidden comment: GSB1C41110SSHR)
J3  TD-105-T-A  [TD-105-T-A]  (value not drawn)
J4  TD-102-T-A  [TD-102-T-A]  (value not drawn)
R7  value 22Ω  [RES 0603]  (hidden comment: RMCF0603FT22R0)
R8  value 5.1kΩ  [RES 0603]  (hidden comment: RC0603FR-075K1L)
R9  value 22Ω  [RES 0603]  (hidden comment: RMCF0603FT22R0)
R10  value 0Ω  [RES 0603]  (hidden comment: RMCF0603ZT0R00)
R11  value 5.1kΩ  [RES 0603]  (hidden comment: RC0603FR-075K1L)
R12  value 0Ω  [RES 0603]  (hidden comment: RMCF0603ZT0R00)
R13  value 0Ω  [RES 0603]  (hidden comment: RMCF0603ZT0R00)
R14  value 10kΩ  [RES 0603]  (hidden comment: RMCF0603FT10K0)
R15  value 10kΩ  [RES 0603]  (hidden comment: RMCF0603FT10K0)
R16  value 330Ω  [RES 0603]  (hidden comment: CRG0603F330R)
R17  value 120Ω  [RES 0603]  (hidden comment: ERA-3AEB121V)
R18  value 120Ω  [RES 0603]  (hidden comment: ERA-3AEB121V)
U4  USB TO SERIAL IC - CH340E (10 PA  [10-MSOP]  (value not drawn)
U5  MCP2562-H/SN  [8-SOIC]

### Blocks framed on the sheet
STM32 CH340E UART: C23-C25 D5 J2 R7-R15 U4
STM32 SWD DEBUG: J3
STM32 CAN COM: R17 R18 U5
CAN PORT: J4

### Ports
+3V3 (see COM[1C], COM[3C], COM[3D], ESP32 and Flash[2A], ESP32 and Flash[3A], MCU[2A], MCU[2B], MCU[3A], MCU[3B], MCU[3D], Power[3B], Power[4A]), +3V3 (see COM[1C], COM[3C], COM[4B], ESP32 and Flash[2A], ESP32 and Flash[3A], MCU[2A], MCU[2B], MCU[3A], MCU[3B], MCU[3D], Power[3B], Power[4A]), +3V3 (see COM[1C], COM[3D], COM[4B], ESP32 and Flash[2A], ESP32 and Flash[3A], MCU[2A], MCU[2B], MCU[3A], MCU[3B], MCU[3D], Power[3B], Power[4A]), +3V3 (see COM[3C], COM[3D], COM[4B], ESP32 and Flash[2A], ESP32 and Flash[3A], MCU[2A], MCU[2B], MCU[3A], MCU[3B], MCU[3D], Power[3B], Power[4A]), +5V (see Power[2A], Power[3A]), CANH (see COM[1D]), CANH (see COM[1D], COM[3D]), CANL (see COM[1D]), CANL (see COM[1D], COM[3D]), COM LED (see MCU[3B]), FDCAN1_RX (see MCU[3B]), FDCAN1_TX (see MCU[3B]), NRST (see COM[1C], MCU[2C]), NRST (see COM[3B], MCU[2C]), STM32 BOOT0, STM32 GND (see COM[1B], COM[1D], COM[2C], COM[2D], COM[3B], COM[4D], ESP32 and Flash[2C], MCU[3A], MCU[3D], MCU[4B], Power[1C], Power[2B]), STM32 GND (see COM[1B], COM[1D], COM[2C], COM[2D], COM[3B], ESP32 and Flash[2C], MCU[3A], MCU[3D], MCU[4B], Power[1C], Power[2B]), STM32 GND (see COM[1B], COM[1D], COM[2C], COM[2D], COM[4D], ESP32 and Flash[2C], MCU[3A], MCU[3D], MCU[4B], Power[1C], Power[2B]), STM32 GND (see COM[1B], COM[1D], COM[2C], COM[3B], COM[4D], ESP32 and Flash[2C], MCU[3A], MCU[3D], MCU[4B], Power[1C], Power[2B]), STM32 GND (see COM[1B], COM[1D], COM[2D], COM[3B], COM[4D], ESP32 and Flash[2C], MCU[3A], MCU[3D], MCU[4B], Power[1C], Power[2B]), STM32 GND (see COM[1D], COM[2C], COM[2D], COM[3B], COM[4D], ESP32 and Flash[2C], MCU[3A], MCU[3D], MCU[4B], Power[1C], Power[2B]), STM32 RX UART 1 (see MCU[3B]), STM32 TX UART 1 (see MCU[3B]), SWCLK (see MCU[3B]), SWDIO (see MCU[3B]), SWO (see MCU[3B])

### Nets
GND: C23.2 C24.2 D5.3(K) D6.2 J2.A1_B12(GND_A) J2.B1_A12(GND_B) J2.SH1(SHIELD) J2.SH2(SHIELD) J2.SH3(SHIELD) J2.SH4(SHIELD) J3.3 J3.5 J3.9 R8.1 R11.2 R14.2 R15.2 U4.3(GND) U5.2(VSS) U5.8(STBY) ; port STM32 GND, port STM32 BOOT0
Vout: U5.3(VDD) ; port +5V
NetC4_1: C23.1 C24.1 J3.1 R10.2 R15.1 U5.5(VIO) ; port +3V3
NetC16_1: C25.1 J3.10 ; port NRST
NetC25_2: C25.2 R12.2
NetD5_1: D5.1(K1) R7.2 U4.1(UD+)
NetD5_2: D5.2(K2) R9.2 U4.2(UD-)
NetD6_1: D6.1 R16.2
NetJ2_A5: J2.A5(CC1) R8.2
NetJ2_A6: J2.A6(DP1) J2.B6(DP2) R7.1
NetJ2_A7: J2.A7(DN1) J2.B7(DN2) R9.1
NetJ2_B5: J2.B5(CC2) R11.1
NetJ3_2: J3.2 ; port SWDIO
NetJ3_4: J3.4 ; port SWCLK
NetJ3_6: J3.6 ; port SWO
NetJ4_01: J4.01(1) J4.04(4) R17.2 ; port CANH
NetJ4_02: J4.02(2) J4.03(3) R18.2 ; port CANL
NetR10_1: R10.1 U4.7(VCC)
NetR12_1: R12.1 U4.5(CTS#)
NetR13_1: R13.1 U4.4(RTS#)
NetR13_2: R13.2 R14.1
NetR16_1: R16.1 ; port COM LED
NetR17_1: R17.1 U5.7(CANH)
NetR18_1: R18.1 U5.6(CANL)
NetU3_31: U4.9(RXD) ; port STM32 TX UART 1
NetU3_32: U4.8(TXD) ; port STM32 RX UART 1
NetU3_33: U5.4(RXD) ; port FDCAN1_RX
NetU3_34: U5.1(TXD) ; port FDCAN1_TX

Not connected (* = marked no-connect by the designer): J2 A4_B9(VBUS_A)* A8(SBU1)* B4_A9(VBUS_B)* B8(SBU2)*; J3 7* 8*; U4 6(TNOW)* 10(V3)*

### Notes on the sheet
- CTS → 0.1 µF → NRST: Reset pulse üretir, MCU(STM32)’yu otomatik resetler.
  RTS → BOOT0 (10k dirençlerle): Bootloader moduna geçiş için kısa süre BOOT0’u 1’e çeker.
  Kullanım: USB üzerinden programlama sırasında manuel düğmeye gerek kalmadan MCU otomatik olarak resetlenir ve bootloader’a girer. Eğer bu özellikler kullanılmayacaksa pcB üzerindeki jumperlar sökülebilir
- COM LED